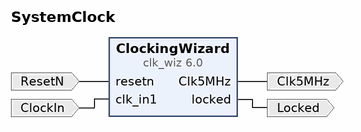
[diagram p0: block diagram of the top level]
# Vivado block design SystemClock, xc7z010clg400-1, Vivado 2019.2
create_bd_design SystemClock

create_bd_port -dir I -type rst ResetN
create_bd_port -dir I -type clk ClockIn
set_property -dict {CONFIG.ASSOCIATED_RESET ResetN CONFIG.FREQ_HZ 125000000} [get_bd_ports ClockIn]
create_bd_port -dir O Locked
create_bd_port -dir O -type clk Clk5MHz
set_property -dict {CONFIG.FREQ_HZ 5000000} [get_bd_ports Clk5MHz]

create_bd_cell -type ip -vlnv xilinx.com:ip:clk_wiz:6.0 ClockingWizard
set_property -dict [list \
  CONFIG.CLKIN1_JITTER_PS 80.0 \
  CONFIG.CLKOUT1_JITTER 529.616 \
  CONFIG.CLKOUT1_PHASE_ERROR 319.966 \
  CONFIG.CLKOUT1_REQUESTED_OUT_FREQ 5 \
  CONFIG.CLK_OUT1_PORT Clk5MHz \
  CONFIG.MMCM_CLKFBOUT_MULT_F 25.500 \
  CONFIG.MMCM_CLKIN1_PERIOD 8.000 \
  CONFIG.MMCM_CLKIN2_PERIOD 10.0 \
  CONFIG.MMCM_CLKOUT0_DIVIDE_F 127.500 \
  CONFIG.MMCM_DIVCLK_DIVIDE 5 \
  CONFIG.PRIM_IN_FREQ 125.000 \
  CONFIG.RESET_PORT resetn \
  CONFIG.RESET_TYPE ACTIVE_LOW \
] [get_bd_cells ClockingWizard]

# ---- connections ----

connect_bd_net -net resetn_0_1 [get_bd_ports ResetN] [get_bd_pins ClockingWizard/resetn]
connect_bd_net -net clk_in1_0_1 [get_bd_ports ClockIn] [get_bd_pins ClockingWizard/clk_in1]
connect_bd_net [get_bd_pins ClockingWizard/locked] [get_bd_ports Locked]
connect_bd_net [get_bd_pins ClockingWizard/Clk5MHz] [get_bd_ports Clk5MHz]

validate_bd_design
save_bd_design
